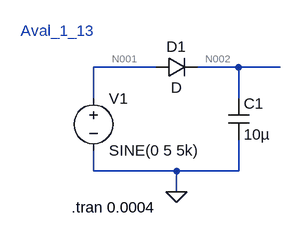
[diagram p0: schematic Draft2.asc]
Draft2.asc, the LTspice schematic file:
Version 4
SHEET 1 880 680
WIRE 192 112 96 112
WIRE 320 112 256 112
WIRE 384 112 320 112
WIRE 96 160 96 112
WIRE 320 160 320 112
WIRE 96 272 96 240
WIRE 224 272 96 272
WIRE 320 272 320 224
WIRE 320 272 224 272
WIRE 224 304 224 272
FLAG 224 304 0
SYMBOL voltage 96 144 R0
WINDOW 123 0 0 Left 0
WINDOW 39 0 0 Left 0
SYMATTR InstName V1
SYMATTR Value SINE(0 5 5k)
SYMBOL cap 304 160 R0
SYMATTR InstName C1
SYMATTR Value 10µ
SYMBOL diode 192 128 R270
WINDOW 0 32 32 VTop 2
WINDOW 3 0 32 VBottom 2
SYMATTR InstName D1
TEXT 62 328 Left 2 !.tran 0.0004
TEXT -16 56 Left 2 ;Aval_1_13

The netlist it stands for:
* Draft2.asc
V1 N001 0 SINE(0 5 5k)
C1 N002 0 10µ
D1 N001 N002 D
.model D D
.lib standard.dio
.tran 0.0004
* Aval_1_13
.backanno
.end

* Results of the author's LTspice run, read from the files saved beside the schematic
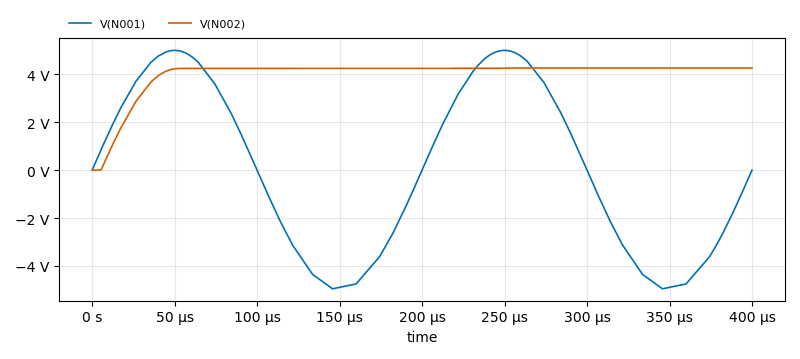
[diagram p1: Transient Analysis of Draft2.asc, plotted from the saved traces]
* Transient Analysis, 1 run:
*   V(N001): min -4.956 V, max 5 V, average 13.17 mV, rms 3.523 V, last 0 V
*   V(N002): min 0 V, max 4.264 V, average 4.021 V, rms 4.102 V, last 4.264 V